# EAGLE schematic bq24123 (EAGLE 6.2)
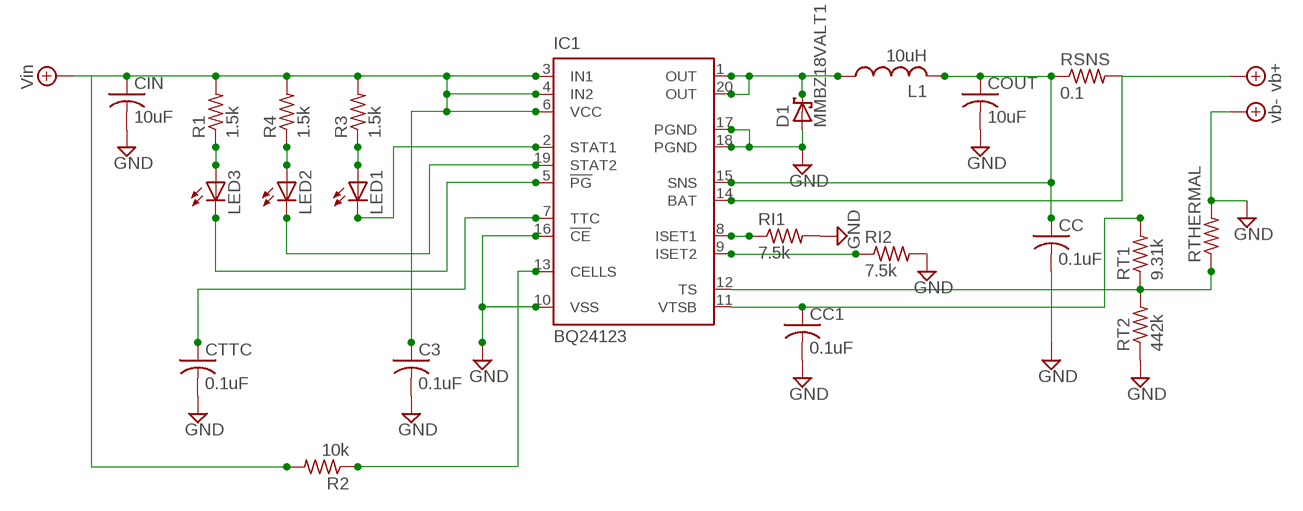
[diagram p0: schematic, sheet 1]

## Parts
C3  0.1uF  C-US025-025X050  [C025-025X050]
CC  0.1uF  C-US025-025X050  [C025-025X050]
CC1  0.1uF  C-US025-025X050  [C025-025X050]
CIN  10uF  C-US025-025X050  [C025-025X050]
COUT  10uF  C-US025-025X050  [C025-025X050]
CTTC  0.1uF  C-US025-025X050  [C025-025X050]
D1  MMBZ18VALT1  1N5908  [C4111-15]
IC1  BQ24123  [QFN20_3,5X4,5]
L1  10uH  L-US0204/5  [0204/5]
LED1  LYW57B  [W57B]
LED2  LYW57B  [W57B]
LED3  LYW57B  [W57B]
R1  1.5k  R-US_0204/2V  [0204V]
R2  10k  R-US_0204/2V  [0204V]
R3  1.5k  R-US_0204/2V  [0204V]
R4  1.5k  R-US_0204/2V  [0204V]
RI1  7.5k  R-US_0204/2V  [0204V]
RI2  7.5k  R-US_0204/2V  [0204V]
RSNS  0.1  R-US_0204/2V  [0204V]
RT1  9.31k  R-US_0204/2V  [0204V]
RT2  442k  R-US_0204/2V  [0204V]
RTHERMAL  R-US_0204/2V  [0204V]

## Nets
+4.1V: C3.1 CIN.1 IC1.3(IN1) IC1.4(IN2) IC1.6(VCC) IC1.14(BAT) R1.2 R2.2 R3.2 R4.2 RSNS.2 RTHERMAL.2 ; supply symbol labelled GND, vb-, vb+, Vin
GND: C3.2 CC1.2 CC.2 CIN.2 COUT.2 CTTC.2 D1.A IC1.10(VSS) IC1.16(!CE) IC1.17(PGND) IC1.18(PGND) RI1.2 RI2.2 RT2.1
N$1: D1.C IC1.1(OUT) IC1.20(OUT) L1.1
N$2: CC.1 COUT.1 IC1.15(SNS) L1.2 RSNS.1
N$4: IC1.8(ISET1) RI1.1
N$5: IC1.9(ISET2) RI2.1
N$6: IC1.12(TS) RT1.1 RT2.2 RTHERMAL.1
N$7: CC1.1 IC1.11(VTSB) RT1.2
N$8: LED3.A R1.1
N$9: LED2.A R4.1
N$10: LED1.A R3.1
N$11: IC1.2(STAT1) LED1.C LED1.C@1(C) LED1.C@2(C) LED1.C@3(C) LED1.C@4(C) LED1.C@5(C)
N$12: IC1.19(STAT2) LED2.C LED2.C@1(C) LED2.C@2(C) LED2.C@3(C) LED2.C@4(C) LED2.C@5(C)
N$13: IC1.5(!PG) LED3.C LED3.C@1(C) LED3.C@2(C) LED3.C@3(C) LED3.C@4(C) LED3.C@5(C)
N$14: CTTC.1 IC1.7(TTC)
N$15: IC1.13(CELLS) R2.1
Unconnected: IC1.EXP IC1.EXP@1 IC1.EXP@2 IC1.EXP@3 IC1.EXP@4 IC1.EXP@5 IC1.EXP@6 IC1.EXP@7 IC1.EXP@8 IC1.EXP@9 IC1.EXP@10 IC1.EXP@11 IC1.EXP@12

## Library data of the parts
C3 CC CC1 CIN COUT CTTC = resistor:C-US: CAPACITOR, American symbol
D1 = diode:1N5908: DIODE schottky
IC1 = texas:BQ24123: SINGLE-CHIP SWITCHMODE, LI-ION AND LI-POLYMER CHARGE-MANAGEMENT IC WITH ENHANCED EMI PERFORMANCE(bqSWITCHER) Source: www.ti.com .. TI-bq24125.pdf; MPN: BQ24123RHLT; OC_FARNELL: 1407131; OC_NEWARK: 84K0851
L1 = resistor:L-US: INDUCTOR, American symbol
LED1-LED3 = led:*W57B: Golden Dragon® 1 Watt LED Place heat sink pads of cathode with INVOKE Source: www.osram-os.com la_ly_w57b.pdf
R1-R4 RI1 RI2 RSNS RT1 RT2 RTHERMAL = resistor:R-US_: RESISTOR, American symbol